# EAGLE design power (EAGLE 9.6.2)
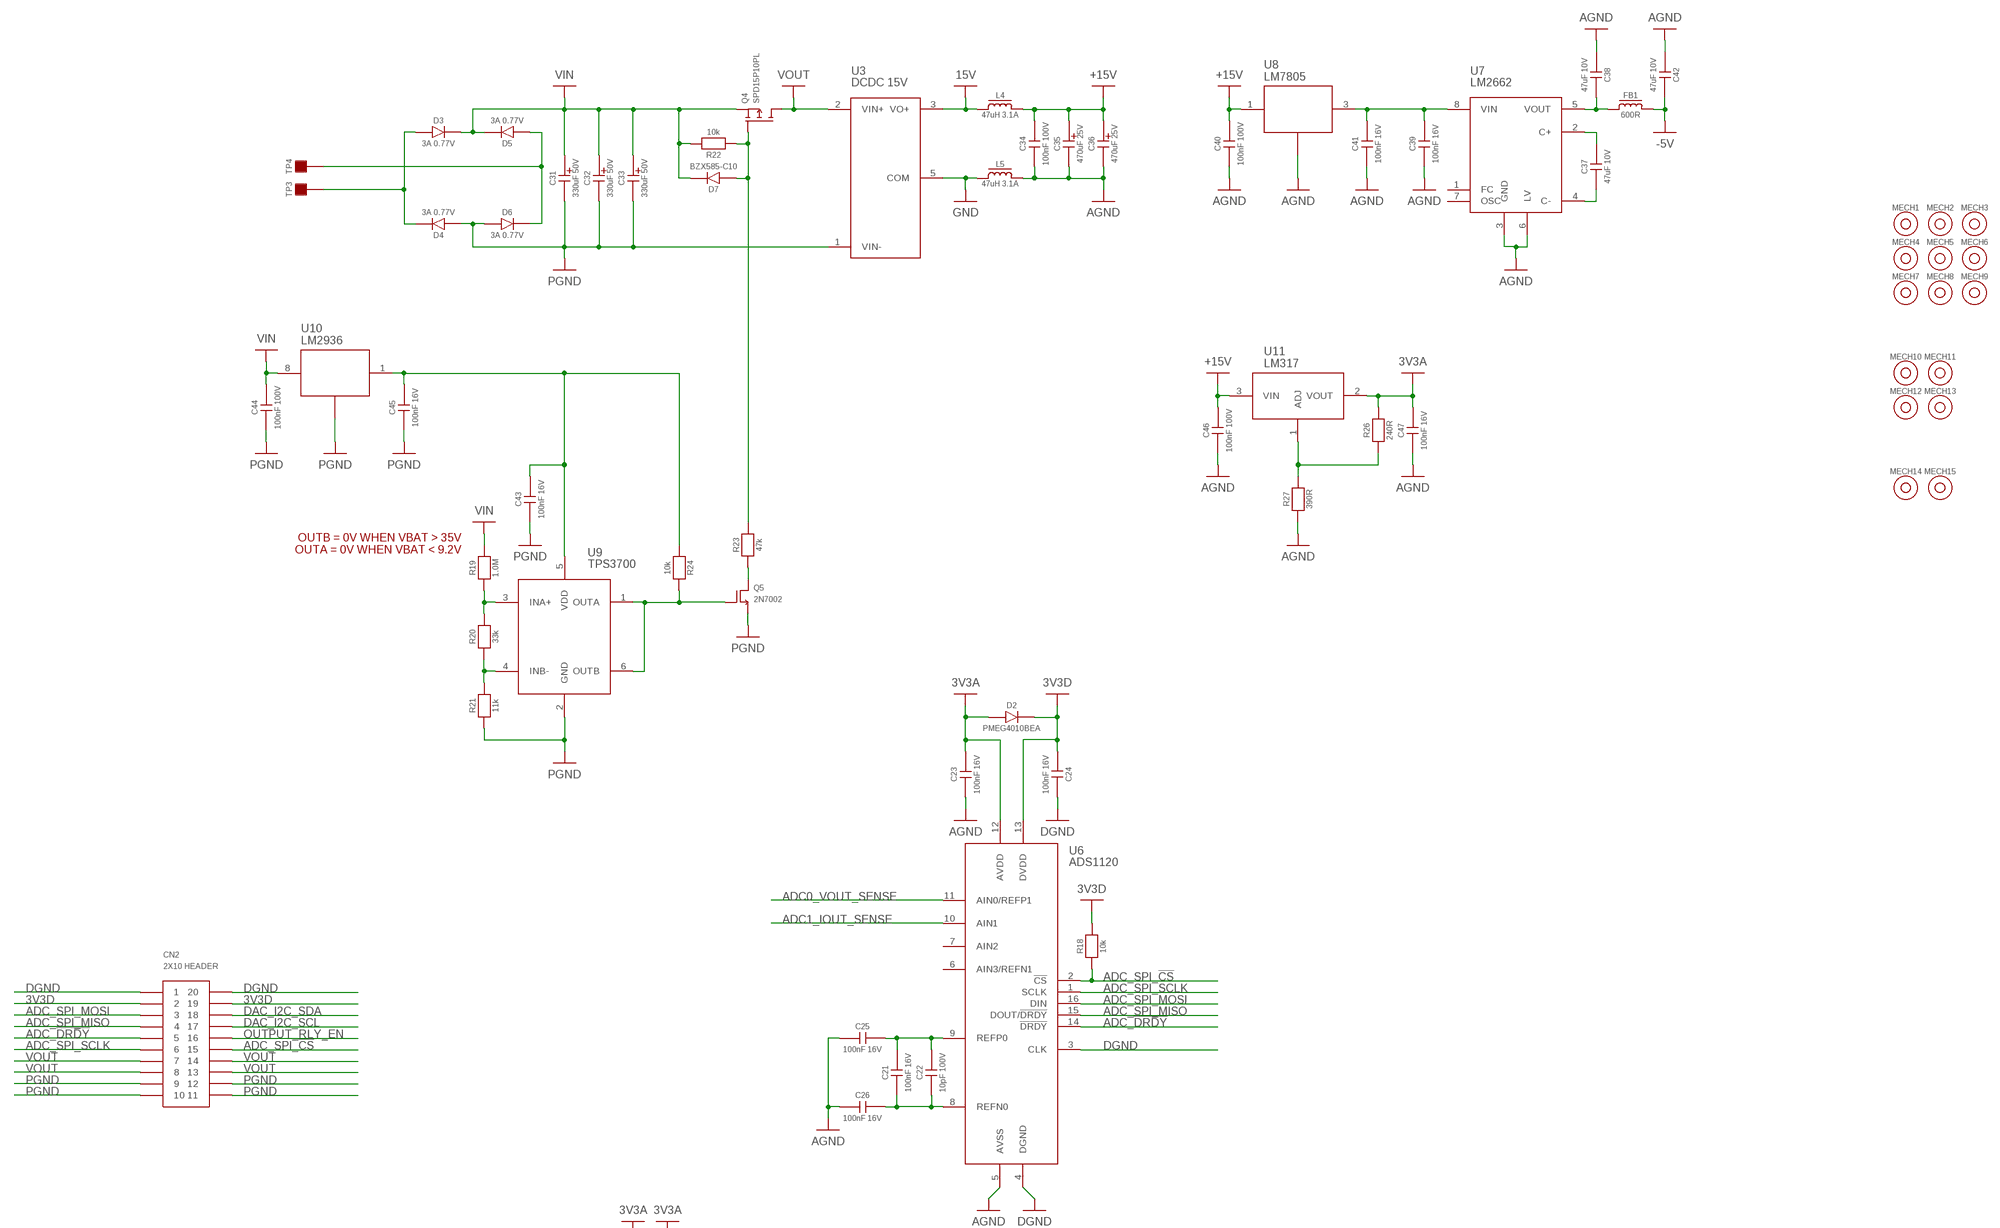
[diagram p0: schematic, sheet 1, part 1 of 2]
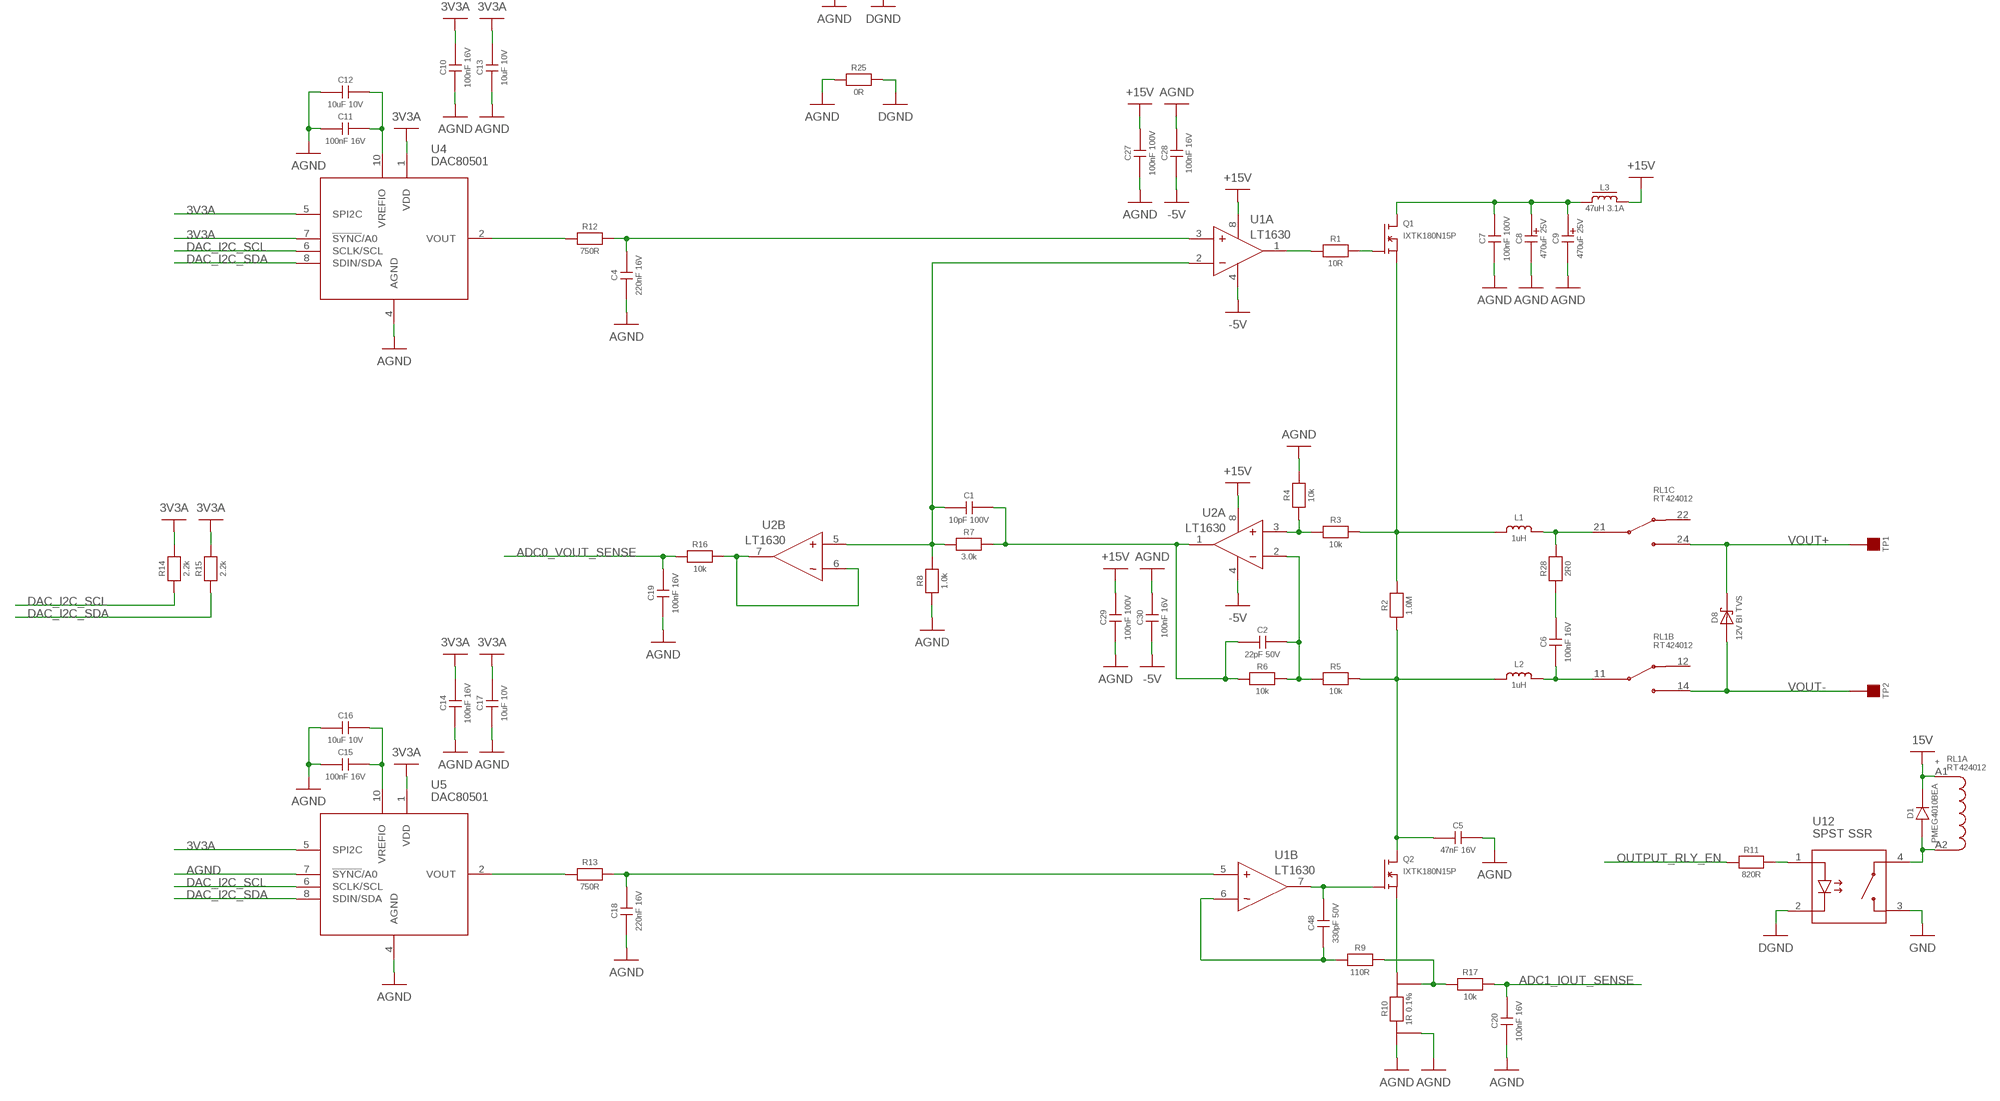
[diagram p1: schematic, sheet 1, part 2 of 2]

## Parts
C1  10pF 100V  06031A100FAT2A  [0603]
C2  22pF 50V  06035A220JAT2A  [0603]
C4  220nF 16V  CC0603KRX7R7BB224  [0603]
C5  47nF 16V  CL10B473KO8NNNC  [0603]
C6  100nF 16V  CL10B104KO8WPNC  [0603]
C7  100nF 100V  06031C104KAT2A  [0603]
C8  470uF 25V  ECA-1EM471  [10MM_RADIAL_5MM_PITCH]
C9  470uF 25V  ECA-1EM471  [10MM_RADIAL_5MM_PITCH]
C10  100nF 16V  CL10B104KO8WPNC  [0603]
C11  100nF 16V  CL10B104KO8WPNC  [0603]
C12  10uF 10V  GRM188R61A106KE69D  [0603]
C13  10uF 10V  GRM188R61A106KE69D  [0603]
C14  100nF 16V  CL10B104KO8WPNC  [0603]
C15  100nF 16V  CL10B104KO8WPNC  [0603]
C16  10uF 10V  GRM188R61A106KE69D  [0603]
C17  10uF 10V  GRM188R61A106KE69D  [0603]
C18  220nF 16V  CC0603KRX7R7BB224  [0603]
C19  100nF 16V  CL10B104KO8WPNC  [0603]
C20  100nF 16V  CL10B104KO8WPNC  [0603]
C21  100nF 16V  CL10B104KO8WPNC  [0603]
C22  10pF 100V  06031A100FAT2A  [0603]
C23  100nF 16V  CL10B104KO8WPNC  [0603]
C24  100nF 16V  CL10B104KO8WPNC  [0603]
C25  100nF 16V  CL10B104KO8WPNC  [0603]
C26  100nF 16V  CL10B104KO8WPNC  [0603]
C27  100nF 100V  06031C104KAT2A  [0603]
C28  100nF 16V  CL10B104KO8WPNC  [0603]
C29  100nF 100V  06031C104KAT2A  [0603]
C30  100nF 16V  CL10B104KO8WPNC  [0603]
C31  330uF 50V  860020675021  [10MM_RADIAL_5MM_PITCH]
C32  330uF 50V  860020675021  [10MM_RADIAL_5MM_PITCH]
C33  330uF 50V  860020675021  [10MM_RADIAL_5MM_PITCH]
C34  100nF 100V  06031C104KAT2A  [0603]
C35  470uF 25V  ECA-1EM471  [10MM_RADIAL_5MM_PITCH]
C36  470uF 25V  ECA-1EM471  [10MM_RADIAL_5MM_PITCH]
C37  47uF 10V  GRM31CR61A476ME15L  [1206]
C38  47uF 10V  GRM31CR61A476ME15L  [1206]
C39  100nF 16V  CL10B104KO8WPNC  [0603]
C40  100nF 100V  06031C104KAT2A  [0603]
C41  100nF 16V  CL10B104KO8WPNC  [0603]
C42  47uF 10V  GRM31CR61A476ME15L  [1206]
C43  100nF 16V  CL10B104KO8WPNC  [0603]
C44  100nF 100V  06031C104KAT2A  [0603]
C45  100nF 16V  CL10B104KO8WPNC  [0603]
C46  100nF 100V  06031C104KAT2A  [0603]
C47  100nF 16V  CL10B104KO8WPNC  [0603]
C48  330pF 50V  CC0603JRNPO9BN331  [0603]
CN2  2X10 HEADER  2X10_HEADER_FEMALE  [2X10PIN_HEADER]
D1  PMEG4010BEA  [SOD-323]
D2  PMEG4010BEA  [SOD-323]
D3  3A 0.77V  PMEG10030ELP  [SOD128]
D4  3A 0.77V  PMEG10030ELP  [SOD128]
D5  3A 0.77V  PMEG10030ELP  [SOD128]
D6  3A 0.77V  PMEG10030ELP  [SOD128]
D7  BZX585-C10  BZT52C10T-7  [SOD_523]
D8  12V BI TVS  SMBJ12CA-13-F  [DO214AC]
FB1  600R  742792651  [0603]
L1  1uH  GS-1R00-1310  [DIY_10X13MM_INDUCTOR]
L2  1uH  GS-1R00-1310  [DIY_10X13MM_INDUCTOR]
L3  47uH 3.1A  SRR1210-470M  [SRR1210]
L4  47uH 3.1A  SRR1210-470M  [SRR1210]
L5  47uH 3.1A  SRR1210-470M  [SRR1210]
MECH1  6mm x 3mm  MOUNTHOLE  [MOUNTHOLE_6X3]
MECH2  6mm x 3mm  MOUNTHOLE  [MOUNTHOLE_6X3]
MECH3  6mm x 3mm  MOUNTHOLE  [MOUNTHOLE_6X3]
MECH4  6mm x 3mm  MOUNTHOLE  [MOUNTHOLE_6X3]
MECH5  6mm x 3mm  MOUNTHOLE  [MOUNTHOLE_6X3]
MECH6  6mm x 3mm  MOUNTHOLE  [MOUNTHOLE_6X3]
MECH7  6mm x 3mm  MOUNTHOLE  [MOUNTHOLE_6X3]
MECH8  6mm x 3mm  MOUNTHOLE  [MOUNTHOLE_6X3]
MECH9  6mm x 3mm  MOUNTHOLE  [MOUNTHOLE_6X3]
MECH10  6mm x 3mm  MOUNTHOLE  [MOUNTHOLE_6X3]
MECH11  6mm x 3mm  MOUNTHOLE  [MOUNTHOLE_6X3]
MECH12  6mm x 3mm  MOUNTHOLE  [MOUNTHOLE_6X3]
MECH13  6mm x 3mm  MOUNTHOLE  [MOUNTHOLE_6X3]
MECH14  6mm x 3mm  MOUNTHOLE  [MOUNTHOLE_6X3]
MECH15  6mm x 3mm  MOUNTHOLE  [MOUNTHOLE_6X3]
Q1  IXTK180N15P  [TO264F]
Q2  IXTK180N15P  [TO264F]
Q4  SPD15P10PL  [TO252]
Q5  2N7002  2N7002P,215  [SOT23-3]
R1  10R  ERJ3EKF10R0V  [0603]
R2  1.0M  ERJ3EKF1004V  [0603]
R3  10k  ERJ3EKF1002V  [0603]
R4  10k  ERJ3EKF1002V  [0603]
R5  10k  ERJ3EKF1002V  [0603]
R6  10k  ERJ3EKF1002V  [0603]
R7  3.0k  ERJ3EKF3001V  [0603]
R8  1.0k  ERJ3EKF1001V  [0603]
R9  110R  ERJ3EKF1100V  [0603]
R10  1R 0.1%  Y16061R00000B9W  [2512_4WIRE]
R11  820R  ERJ3EKF8200V  [0603]
R12  750R  ERJ3EKF7500V  [0603]
R13  750R  ERJ3EKF7500V  [0603]
R14  2.2k  ERJ3EKF2201V  [0603]
R15  2.2k  ERJ3EKF2201V  [0603]
R16  10k  ERJ3EKF1002V  [0603]
R17  10k  ERJ3EKF1002V  [0603]
R18  10k  ERJ3EKF1002V  [0603]
R19  1.0M  ERJ3EKF1004V  [0603]
R20  33k  ERJ3EKF3302V  [0603]
R21  11k  ERJ3EKF1102V  [0603]
R22  10k  ERJ3EKF1002V  [0603]
R23  47k  ERJ3EKF4702V  [0603]
R24  10k  ERJ3EKF1002V  [0603]
R25  0R  CRCW06030000Z0EA  [0603]
R26  240R  ERJ3EKF2400V  [0603]
R27  390R  ERJ3EKF3900V  [0603]
R28  2R0  CRCW12062R00FNEA  [1206]
RL1  RT424012  [30MMDPDTRELAY]
TP1  TEST_POINT_SQUARE  [OSPREY_HSS_PAD]
TP2  TEST_POINT_SQUARE  [OSPREY_HSS_PAD]
TP3  TEST_POINT_SQUARE  [OSPREY_HSS_PAD]
TP4  TEST_POINT_SQUARE  [OSPREY_HSS_PAD]
U1  LT1630  LT1630CS8  [SO8]
U2  LT1630  LT1630CS8  [SO8]
U3  DCDC 15V  PDQE20-Q24-S15-D  [PDQE10]
U4  DAC80501  [VSSOP10]
U5  DAC80501  [VSSOP10]
U6  ADS1120  [TSSOP16]
U7  LM2662  LM2662D  [SO8]
U8  LM7805  7805CTG  [TO220]
U9  TPS3700  TPS3700DDCR  [SOT23-6]
U10  LM2936  LM2936HVMAX-5.0  [SO8]
U11  LM317  LM317T  [TO220]
U12  SPST SSR  CPC1002N  [CPC1002N]

## Nets
3V3A: C10.2 C13.2 C14.2 C17.2 C23.2 C47.2 D2.A R14.2 R15.2 R26.2 U4.1(VDD) U4.5(SPI2C) U4.7(!SYNC!/A0) U5.1(VDD) U5.5(SPI2C) U6.12(AVDD) U11.2(VOUT)
3V3D: C24.1 CN2.2 CN2.19 D2.K R18.2 U6.13(DVDD)
15V: D1.K L4.1 RL1.A1(A:A1) U3.3(VO+)
+15V: C27.2 C29.2 C34.2 C35.2(A) C36.2(A) C40.2 C46.2 L3.2 L4.2 U1.8(A:V+) U2.8(A:V+) U8.1(VIN) U11.3(VIN)
-5V: C28.1 C30.1 C42.2 FB1.2 U1.4(A:V-) U2.4(A:V-)
ADC0_VOUT_SENSE: C19.2 R16.1 U6.11(AIN0/REFP1)
ADC1_IOUT_SENSE: C20.2 R17.2 U6.10(AIN1)
ADC_!DRDY: CN2.5 U6.14(!DRDY)
ADC_SPI_!CS: CN2.15 R18.1 U6.2(!CS)
ADC_SPI_MISO: CN2.4 U6.15(DOUT/!DRDY)
ADC_SPI_MOSI: CN2.3 U6.16(DIN)
ADC_SPI_SCLK: CN2.6 U6.1(SCLK)
AGND: C4.1 C5.2 C7.1 C8.1(K) C9.1(K) C10.1 C11.1 C12.1 C13.1 C14.1 C15.1 C16.1 C17.1 C18.1 C19.1 C20.1 C23.1 C25.1 C26.1 C27.1 C28.2 C29.1 C30.2 C34.1 C35.1(K) C36.1(K) C38.1 C39.1 C40.1 C41.1 C42.1 C46.1 C47.1 L5.2 R4.2 R8.1 R10.1(E1) R10.2(I1) R25.1 R27.1 U4.4(AGND) U5.4(AGND) U5.7(!SYNC!/A0) U6.5(AVSS) U7.3(GND) U7.6(LV) U8.2(GND)
DAC_I2C_SCL: CN2.17 R14.1 U4.6(SCLK/SCL) U5.6(SCLK/SCL)
DAC_I2C_SDA: CN2.18 R15.1 U4.8(SDIN/SDA) U5.8(SDIN/SDA)
DGND: C24.2 CN2.1 CN2.20 R25.2 U6.3(CLK) U6.4(DGND) U12.2(LED_K)
GND: L5.1 U3.5(COM) U12.3(SW2)
N$1: R1.1 U1.1(A:OUT)
N$2: Q1.1(G) R1.2
N$3: L1.1 Q1.3(S) R2.2 R3.2
N$4: C5.1 L2.1 Q2.2(D) R2.1 R5.2
N$5: R3.1 R4.1 U2.3(A:+)
N$6: C2.2 R5.1 R6.2 U2.2(A:-)
N$7: C1.2 C2.1 R6.1 R7.2 U2.1(A:OUT)
N$8: R16.2 U2.6(B:-) U2.7(B:OUT)
N$9: C48.2 Q2.1(G) U1.7(B:OUT)
N$10: C4.2 R12.2 U1.3(A:+)
N$11: C48.1 R9.1 U1.6(B:-)
N$12: L1.2 R28.2 RL1.21
N$13: R11.2 U12.1(LED_A)
N$14: C6.1 L2.2 RL1.11
N$15: R26.1 R27.2 U11.1(ADJ)
N$16: C21.2 C22.2 C25.2 U6.9(REFP0)
N$17: C7.2 C8.2(A) C9.2(A) L3.1 Q1.2(D)
N$18: C18.2 R13.2 U1.5(B:+)
N$19: D1.A RL1.A2(A:A2) U12.4(SW1)
N$20: C11.2 C12.2 U4.10(VREFIO)
N$21: R12.1 U4.2(VOUT)
N$22: C15.2 C16.2 U5.10(VREFIO)
N$23: R13.1 U5.2(VOUT)
N$24: C21.1 C22.1 C26.2 U6.8(REFN0)
N$25: C43.2 C45.2 R24.1 U9.5(VDD) U10.1(VOUT)
N$26: D5.A D6.K TP4.1
N$27: D3.A D4.K TP3.1
N$28: C6.2 R28.1
N$29: Q2.3(S) R10.4(I2)
N$30: C37.2 U7.2(C+)
N$31: C37.1 U7.4(C-)
N$32: C38.2 FB1.1 U7.5(VOUT)
N$33: C39.2 C41.2 U7.8(VIN) U8.3(VOUT)
N$34: R19.1 R20.2 U9.3(INA+)
N$35: R20.1 R21.2 U9.4(INB-)
N$37: D7.A Q4.1(G) R22.1 R23.2
N$38: Q5.2(D) R23.1
N$39: Q5.1(G) R24.2 U9.1(OUTA) U9.6(OUTB)
N$76: R9.2 R10.3(E2) R17.1
N$345: C1.1 R7.1 R8.2 U1.2(A:-) U2.5(B:+)
OUTPUT_RLY_EN: CN2.16 R11.1
PGND: C31.1(K) C32.1(K) C33.1(K) C43.1 C44.1 C45.1 CN2.9 CN2.10 CN2.11 CN2.12 D4.A D6.A Q5.3(S) R21.1 U3.1(VIN-) U9.2(GND) U10.2(GND) U10.3(GND) U10.6(GND) U10.7(GND)
VIN: C31.2(A) C32.2(A) C33.2(A) C44.2 D3.K D5.K D7.K Q4.3(S) R19.2 R22.2 U10.8(VIN)
VOUT: CN2.7 CN2.8 CN2.13 CN2.14 Q4.2(D) U3.2(VIN+)
VOUT+: D8.K RL1.24 TP1.1
VOUT-: D8.A RL1.14 TP2.1
Unconnected: RL1.12 RL1.22 U6.6(AIN3/REFN1) U6.7(AIN2) U7.1(FC) U7.7(OSC)

## Notes on the sheet
- OUTB = 0V WHEN VBAT > 35V
  OUTA = 0V WHEN VBAT < 9.2V

## Library data of the parts
C1 C22 = CAPACITORS:06031A100FAT2A: 10pF 100V C0G/NP0 1% 0603 MLCC.; DIGIKEY: 478-5769-1-ND; HEIGHT: 1; PRICE_PER: 0.23
C2 = CAPACITORS:06035A220JAT2A: 22pF 50V C0G/NP0 5% 0603 MLCC.; DIGIKEY: 478-1167-1-ND; HEIGHT: 1; PRICE_PER: 0.08
C4 C18 = CAPACITORS:CC0603KRX7R7BB224: 220nF 16V X7R 10% 0603 MLCC.; DIGIKEY: 311-1426-1-ND; HEIGHT: 1; PRICE_PER: 0.08
C5 = CAPACITORS:CL10B473KO8NNNC: 47nF 16V X7R 10% 0603 MLCC.; DIGIKEY: 1276-2079-1-ND; HEIGHT: 1; PRICE_PER: 0.08
C6 C10 C11 C14 C15 C19-C21 C23-C26 C28 C30 C39 C41 C43 C45 C47 = CAPACITORS:CL10B104KO8WPNC: 100nF 16V X7R 10% 0603 MLCC; DIGIKEY: 1276-6582-1-ND; HEIGHT: 1; PRICE_PER: 0.08
C7 C27 C29 C34 C40 C44 C46 = CAPACITORS:06031C104KAT2A: 100nF 100V X7R 10% 0603 MLCC.; DIGIKEY: 478-10047-1-ND; HEIGHT: 1; PRICE_PER: 0.14
C8 C9 C35 C36 = CAPACITORS:ECA-1EM471: 470uF 25V Electrolytic 20% 10mm radial.; DIGIKEY: P5155-ND; HEIGHT: 14; PRICE_PER: 0.37
C12 C13 C16 C17 = CAPACITORS:GRM188R61A106KE69D: 10uF 10V X5R 10% 0603 MLCC.; DIGIKEY: 490-10474-1-ND; HEIGHT: 0.95; PRICE_PER: 0.17
C31-C33 = CAPACITORS:860020675021: 330uF 50V Electrolytic 20% 10mm radial 16mm height.; DIGIKEY: 732-8867-1-ND; HEIGHT: 17.5; PRICE_PER: 0.52
C37 C38 C42 = CAPACITORS:GRM31CR61A476ME15L: 47uF 10V X5R 20% 1206 MLCC.; DIGIKEY: 490-5528-1-ND; HEIGHT: 2; PRICE_PER: 0.65
C48 = CAPACITORS:CC0603JRNPO9BN331: 330pF 50V C0G/NP0 5% 0603 MLCC; DIGIKEY: 311-1075-1-ND; HEIGHT: 1; PRICE_PER: 0.1
CN2 = CONNECTORs:2X10_HEADER_FEMALE: A 2 row, 10 column, 20 pin 0.1" female header.; DIGIKEY: 2057-RS2-20-G-ND; HEIGHT: 8.5; PRICE_PER: 0.85
D1 D2 = DIODES:PMEG4010BEA: 1A, 40V Schottkey rectifier. SOD323.; DIGIKEY: 1727-5211-1-ND; HEIGHT: 1.2; PRICE_PER: 0.29
D3-D6 = DIODES:PMEG10030ELP: Schottky Rectifier, 100 V, 3 A, Single, SOD-128, 2 Pins, 770 mV; DIGIKEY: 1727-2397-1-ND; HEIGHT: 3; PRICE_PER: 0.37
D7 = DIODES:BZT52C10T-7: Zener Single Diode, 10 V, 300 mW, SOD-523, 2, 150 °C; DIGIKEY: BZT52C10T-7DICT-ND; HEIGHT: 1; PRICE_PER: 0.16
D8 = DIODES:SMBJ12CA-13-F: 19.9V Clamp 30.2A Ipp Tvs Diode Surface Mount SMB; DIGIKEY: SMBJ12CA-FDICT-ND; HEIGHT: 2.5; PRICE_PER: 0.29
FB1 = INDUCTORS:742792651: Ferrite Bead 600R at 100MHz 0603.; DIGIKEY: 732-1593-1-ND; HEIGHT: 1; PRICE_PER: 0.13
L1 L2 = INDUCTORS:GS-1R00-1310: A 1uH inductor made from ten 13mm diameter turns from 1mm diameter enamled wire.; HEIGHT: 14
L3-L5 = INDUCTORS:SRR1210-470M: 47µH Shielded Wirewound Inductor 3.8A 72 mOhm Max Nonstandard; DIGIKEY: SRR1210-470MCT-ND; HEIGHT: 10; PRICE_PER: 1
MECH1-MECH15 = MISC:MOUNTHOLE: Mechanical mounting hole.
Q1 Q2 = TRANSISTORs:IXTK180N15P: N Channel, 180 A, 150 V, 10 mohm, 10 V, 5 V; DIGIKEY: IXTK180N15P-ND; HEIGHT: 29; PRICE_PER: 9.57
Q4 = TRANSISTORs:SPD15P10PL: INFINEON SPD15P10PL G MOSFET Transistor, P Channel, -15 A, -100 V, 0.14 ohm, -10 V, -1.5 V; DIGIKEY: SPD15P10PLGBTMA1CT-ND; HEIGHT: 4; PRICE_PER: 1.29
Q5 = TRANSISTORs:2N7002: N-Channel 60V 360mA (Ta) 350mW (Ta) Surface Mount TO-236AB (SOT23); DIGIKEY: 1727-4692-1-ND; HEIGHT: 1; PRICE_PER: 0.15
R1 = r_0603:ERJ3EKF10R0V: 10 10R 0603 0.1W 1% thick film resistor.; DIGIKEY: P10.0HCT-ND; PRICE_PER: 0.10000
R2 R19 = r_0603:ERJ3EKF1004V: 1000000 1.0M 0603 0.1W 1% thick film resistor.; DIGIKEY: P1.00MHCT-ND; PRICE_PER: 0.10000
R3-R6 R16-R18 R22 R24 = r_0603:ERJ3EKF1002V: 10000 10k 0603 0.1W 1% thick film resistor.; DIGIKEY: P10.0KHCT-ND; PRICE_PER: 0.10000
R7 = r_0603:ERJ3EKF3001V: 3000 3.0k 0603 0.1W 1% thick film resistor.; DIGIKEY: P3.00KHCT-ND; PRICE_PER: 0.10000
R8 = r_0603:ERJ3EKF1001V: 1000 1.0k 0603 0.1W 1% thick film resistor.; DIGIKEY: P1.00KHCT-ND; PRICE_PER: 0.10000
R9 = r_0603:ERJ3EKF1100V: 110 110R 0603 0.1W 1% thick film resistor.; DIGIKEY: P110HCT-ND; PRICE_PER: 0.10000
R10 = RESISTORS:Y16061R00000B9W: 1 Ohms ±0.1% 1W Chip Resistor Wide 2516 (6440 Metric), 1625 Current Sense, Moisture Resistant, Non-Inductive Metal Foil; DIGIKEY: Y1606-1.0B-ND; HEIGHT: 1; PRICE_PER: 12.53
R11 = r_0603:ERJ3EKF8200V: 820 820R 0603 0.1W 1% thick film resistor.; DIGIKEY: P820HCT-ND; PRICE_PER: 0.10000
R12 R13 = r_0603:ERJ3EKF7500V: 750 750R 0603 0.1W 1% thick film resistor.; DIGIKEY: P750HCT-ND; PRICE_PER: 0.10000
R14 R15 = r_0603:ERJ3EKF2201V: 2200 2.2k 0603 0.1W 1% thick film resistor.; DIGIKEY: P2.20KHCT-ND; PRICE_PER: 0.10000
R20 = r_0603:ERJ3EKF3302V: 33000 33k 0603 0.1W 1% thick film resistor.; DIGIKEY: P33.0KHCT-ND; PRICE_PER: 0.10000
R21 = r_0603:ERJ3EKF1102V: 11000 11k 0603 0.1W 1% thick film resistor.; DIGIKEY: P11.0KHCT-ND; PRICE_PER: 0.10000
R23 = r_0603:ERJ3EKF4702V: 47000 47k 0603 0.1W 1% thick film resistor.; DIGIKEY: P47.0KHCT-ND; PRICE_PER: 0.10000
R25 = RESISTORS:CRCW06030000Z0EA: 0 0R 0603 0.1W thick film resistor; DIGIKEY: 541-0.0GCT-ND; HEIGHT: 0.5; PRICE_PER: 0.08
R26 = r_0603:ERJ3EKF2400V: 240 240R 0603 0.1W 1% thick film resistor.; DIGIKEY: P240HCT-ND; PRICE_PER: 0.10000
R27 = r_0603:ERJ3EKF3900V: 390 390R 0603 0.1W 1% thick film resistor.; DIGIKEY: P390HCT-ND; PRICE_PER: 0.10000
R28 = RESISTORS:CRCW12062R00FNEA: 2 2R0 1206 0.25W 1% thick film resistor; DIGIKEY: 311-2.0ERCT-ND; HEIGHT: 0.65; PRICE_PER: 0.09
RL1 = ELECTROMECH:RT424012: General Purpose Relay DPDT (2 Form C) 12VDC Coil Through Hole; DIGIKEY: PB967-ND; HEIGHT: 16; PRICE_PER: 1.83
TP1-TP4 = MISC:TEST_POINT_SQUARE: A square pad initially made for the HSS wiring
U1 U2 = ICs:LT1630: 30MHz, 10V/µs, Dual Rail-to-Rail Input and Output Precision Op Amps; DIGIKEY: LT1630CS8#PBF-ND; HEIGHT: 2; PRICE_PER: 5.86
U3 = ICs:PDQE20-Q24-S15-D: Isolated Module DC DC Converter 1 Output 15V 1.333A 9V - 36V Input; DIGIKEY: 102-6269-ND; HEIGHT: 12; PRICE_PER: 17.06
U4 U5 = ICs:DAC80501: 16-Bit 1-LSB INL, Voltage-Output DAC With Precision Internal Reference; DIGIKEY: 296-DAC80501ZDGSRCT-ND; HEIGHT: 1; PRICE_PER: 4.40
U6 = ICs:ADS1120: ADS1120 4-Channel, 2-kSPS, Low-Power, 16-Bit ADC with Integrated PGA and Reference; DIGIKEY: 296-37280-1-ND; HEIGHT: 1; PRICE_PER: 5.25
U7 = ICs:LM2662: Low cost. SO8. LM266x switched capacitor negative voltage rail generator.; DIGIKEY: LM2662MX/NOPBCT-ND; HEIGHT: 1.5; PRICE_PER: 1.73
U8 = ICs:78: Linear Voltage Regulator, 78xx, Fixed, Positive, TO-220-3, 1.0 A Fixed Positive Voltage Regulators; DIGIKEY: MC7805CTGOS-ND; PRICE_PER: 0.35
U9 = ICs:TPS3700: Analogue Comparator, Rail to Rail, Voltage, 2, 1.8V to 18V, SOT-23, 6 Pins; DIGIKEY: 296-30395-1-ND; HEIGHT: 1; PRICE_PER: 1.46
U10 = ICs:LM2936HVMAX-5.0: Linear Voltage Regulator IC Positive Fixed 1 Output 5V 50mA 8-SOIC; DIGIKEY: LM2936HVMAX-5.0/NOPBCT-ND; HEIGHT: 1.5; PRICE_PER: 1.56
U11 = ICs:LM317: Linear Voltage Regulator, Adjustable, 38V primary input, 1.2V to 32V/100 mA/1 Output; DIGIKEY: 497-1575-5-ND; HEIGHT: 19; PRICE_PER: 0.5
U12 = ICs:CPC1002N: Solid State SPST-NO (1 Form A) 4-SOP (0.150", 3.81mm); DIGIKEY: CLA221-ND; HEIGHT: 2.1; PRICE_PER: 0.87

## Board
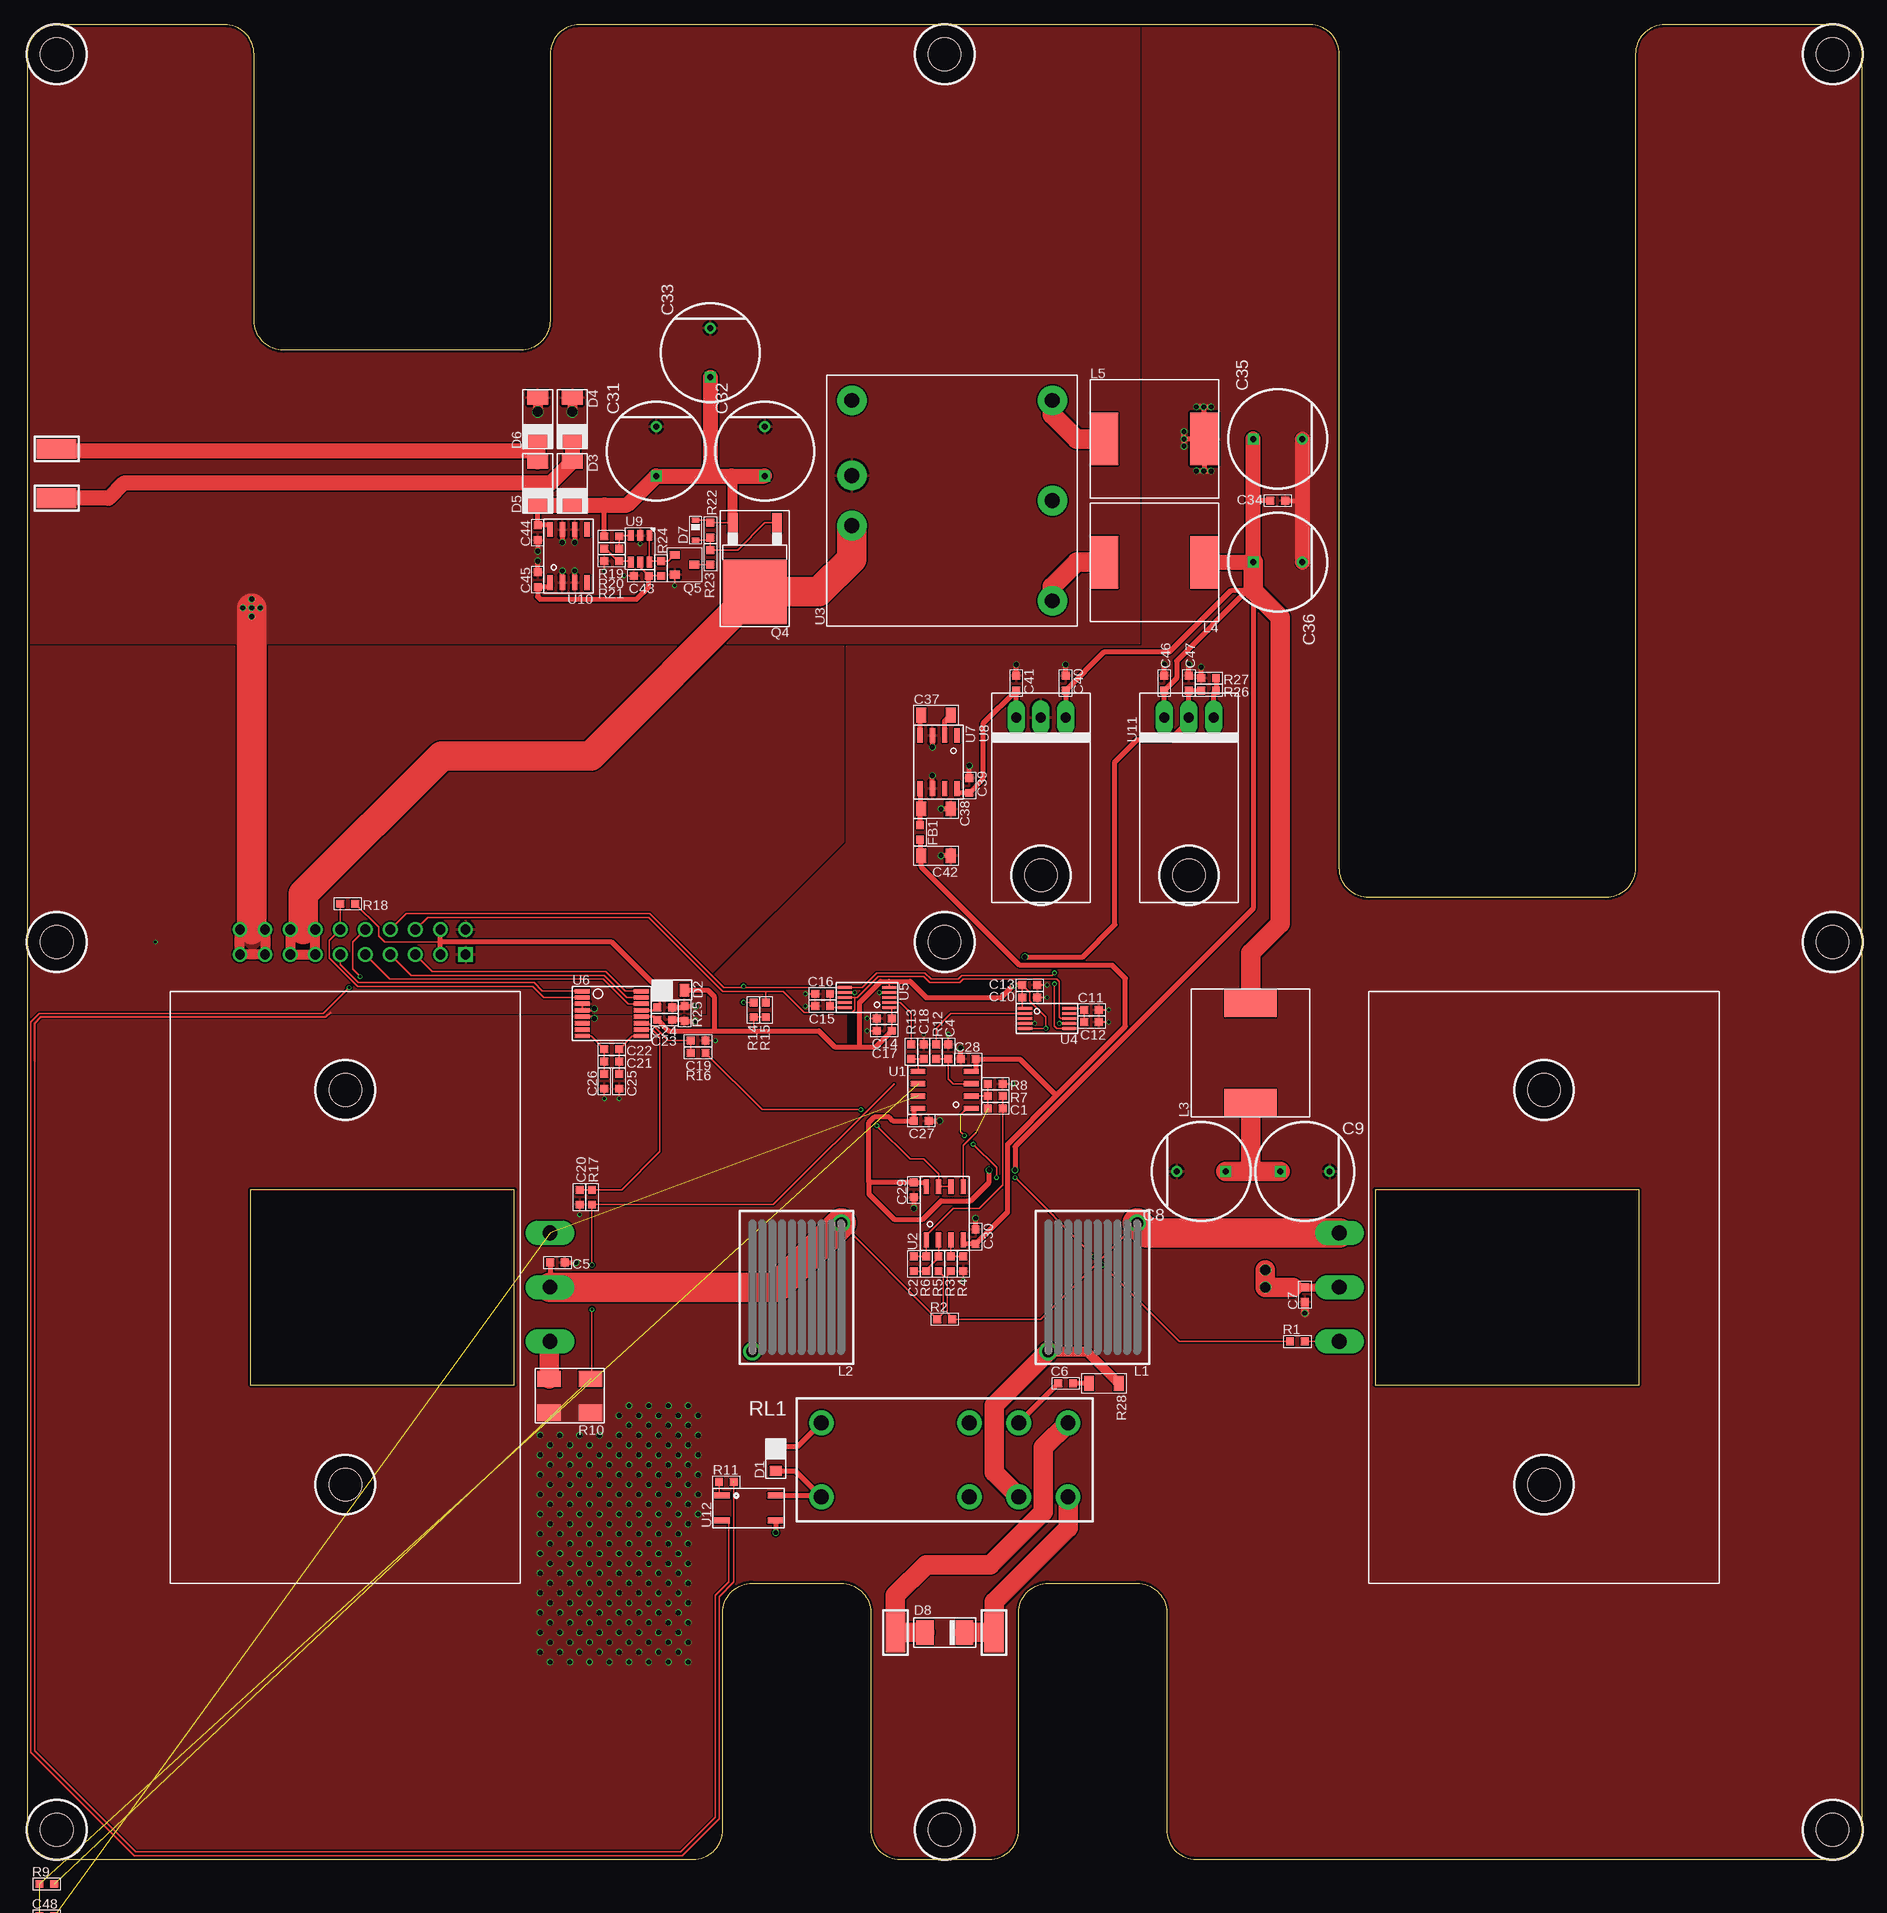
[diagram p2: board, top side]
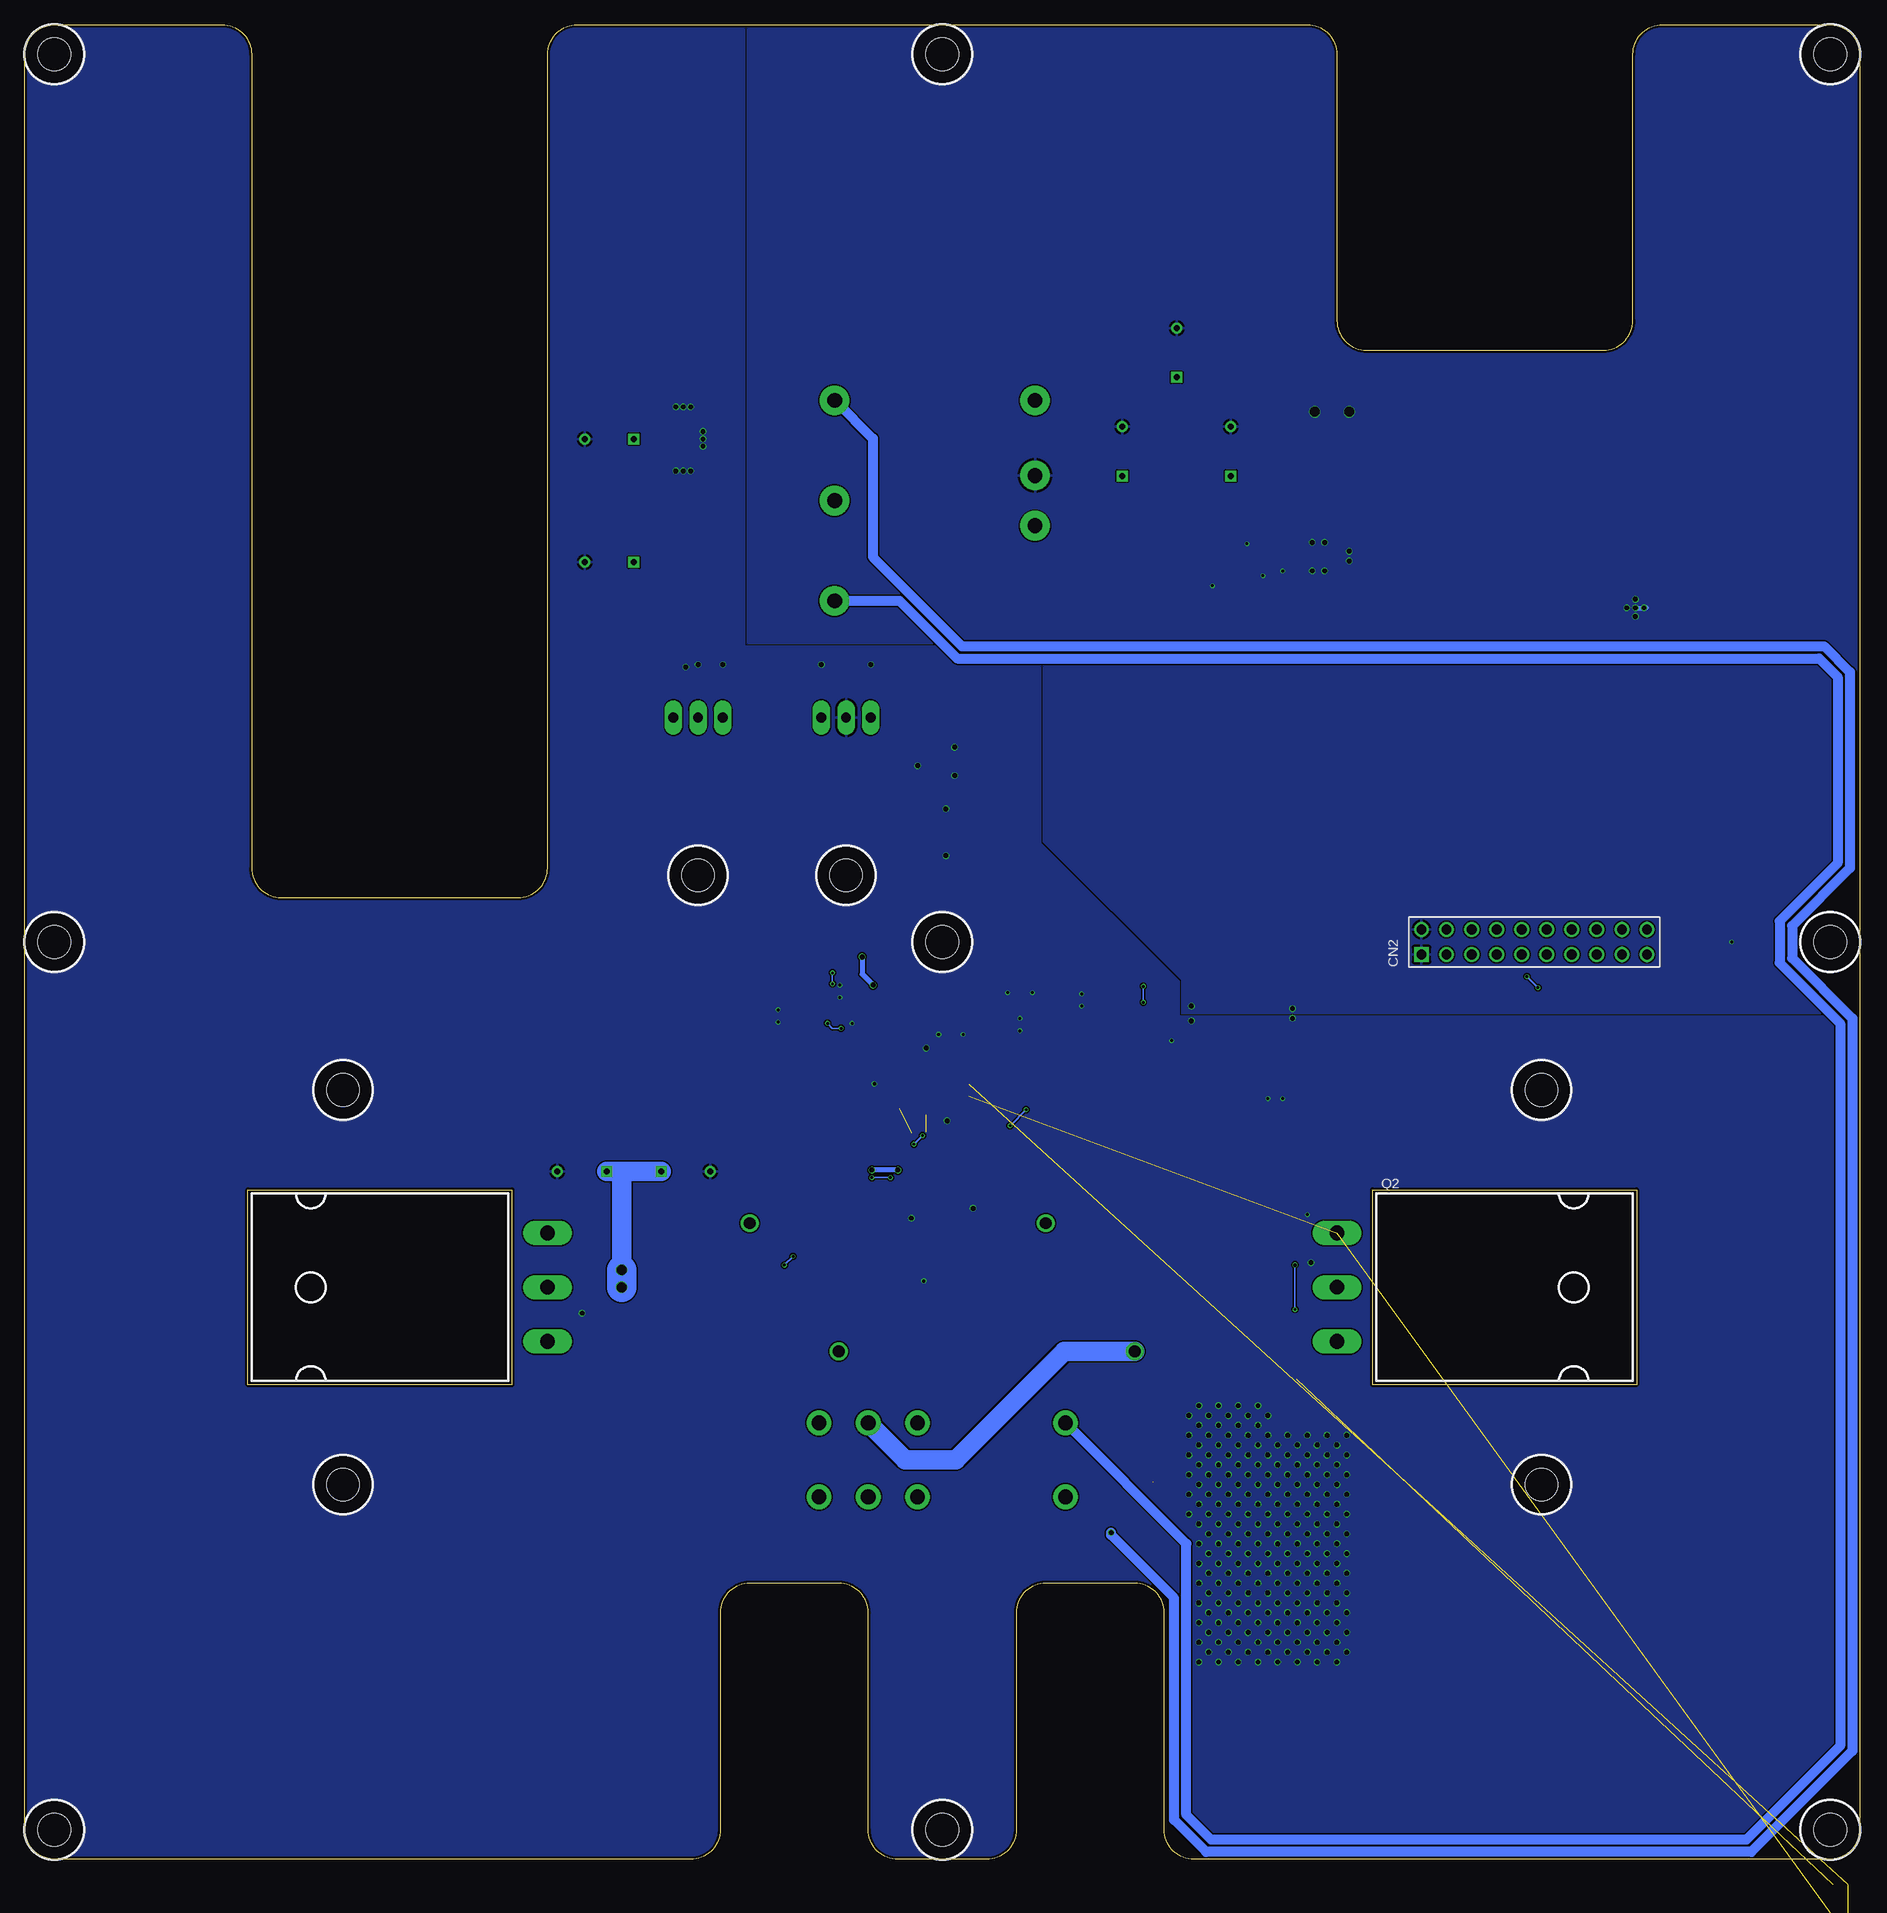
[diagram p3: board, bottom side, seen from below]

Size 186 x 186 mm. Coordinates in mm from the lower left corner, seen from the top.
Outline: 183,0 arc90 186,3 186,183 arc90 183,186 166,186 arc90 163,183 163,100.5 arc-90 160,97.5 136,97.5 arc-90 133,100.5 133,183 arc90 130,186 56,186 arc90 53,183 53,156 arc-90 50,153 26,153 arc-90 23,156 23,183 arc90 20,186 3,186 arc90 0,183 0,3 arc90 3,0 67.5,0 arc90 70.5,3 70.5,25 arc-90 73.5,28 82.5,28 arc-90 85.5,25 85.5,3 arc90 88.5,0 97.5,0 arc90 100.5,3 100.5,25 arc-90 103.5,28 112.5,28 arc-90 115.5,25 115.5,3 arc90 118.5,0 183,0
Outline: 22.62,48.12 49.38,48.12 49.38,67.88 22.62,67.88 22.62,48.12
Outline: 163.38,67.88 136.62,67.88 136.62,48.12 163.38,48.12 163.38,67.88
Copper layers (1*2*3*16): Top 0.035mm / dielectric 0.15mm / PWR 0.035mm / dielectric 1.11mm / GND 0.035mm / dielectric 0.2mm / Bottom 0.035mm
Design rules "myDRC 4 layers 0.15mm": minimum track width 0.15mm, minimum drill 0.25mm, track to track 0.15mm, track to pad 0.15mm, pad to pad 0.15mm, via to via 0.15mm, smd to smd 0mil, copper to edge 0.25mm, drill to drill 0.25mm, minimum pad ring 10mil, minimum via ring 3mil, stop-mask expansion 4mil, vias tented up to drill 1mm, thermal gap 10mil

### Footprints (pad centres in the part's own frame; a part is rotated, then mirrored left to right if it is on the bottom)
0603 = smd 0.8 x 0.8: 1 -0.75,0; 2 0.75,0
10MM_RADIAL_5MM_PITCH = drill 0.6: 1 2.5,0 | drill 0.6 square: 2 -2.5,0
1206 = smd 1 x 1.5: 1 1.5,0; 2 -1.5,0
2X10PIN_HEADER = drill 1 pad 1.5 square: 1 -1.27,11.43 | drill 1 pad 1.5: 2 -1.27,8.89; 3 -1.27,6.35; 4 -1.27,3.81; 5 -1.27,1.27; 6 -1.27,-1.27; 7 -1.27,-3.81; 8 -1.27,-6.35; 9 -1.27,-8.89; 10 -1.27,-11.43; 11 1.27,-11.43; 12 1.27,-8.89; 13 1.27,-6.35; 14 1.27,-3.81; 15 1.27,-1.27; 16 1.27,1.27; 17 1.27,3.81; 18 1.27,6.35; 19 1.27,8.89; 20 1.27,11.43
SOD-323 = smd 1 x 1.25: A -1.25,0; K 1.25,0
SOD128 = smd 1.4 x 2.1: A -2.2,0; K 2.2,0
SOD_523 = smd 0.5 x 0.75: A -1,0; K 1,0
DO214AC = smd 1.75 x 2.5: A -2,0; K 2,0
DIY_10X13MM_INDUCTOR = drill 1.2: 1 -4.5,-6.5; 2 4.5,6.5
SRR1210 = smd 2.8 x 5.3: 1 -5.05,0; 2 5.05,0
MOUNTHOLE_6X3 = hole 3.3: 0,0
TO264F = drill 1.5 pad 2.5 long: 1 -5.5,0; 2 0,0; 3 5.5,0
TO252 = smd 1 x 2: 1 -2.25,-5.25; 3 2.25,-5.25 | smd 6.5 x 6.5: 2 0,1.75
SOT23-3 = smd 0.8 x 1: 1 -1,-1; 2 0,1; 3 1,-1
2512_4WIRE = smd 2.4 x 1.65: 1 -2.1,1.7; 2 2.1,1.7; 3 -2.1,-1.7; 4 2.1,-1.7
30MMDPDTRELAY = drill 1.5 pad 2.5: 11 7.5,3.75; 12 2.5,3.75; 14 12.5,3.75; 21 7.5,-3.75; 22 2.5,-3.75; 24 12.5,-3.75; A1 -12.5,3.75; A2 -12.5,-3.75
OSPREY_HSS_PAD = smd 4 x 2: 1 0,0
SO8 = smd 1.5 x 0.55: 1 -2.7,1.875; 2 -2.7,0.625; 3 -2.7,-0.625; 4 -2.7,-1.875; 5 2.7,-1.875; 6 2.7,-0.625; 7 2.7,0.625; 8 2.7,1.875
PDQE10 = drill 1.5 pad 3: 1 2.54,10.16; 2 -2.54,10.16; 3 -10.16,-10.16; 4 0,-10.16; 5 10.16,-10.16; 6 10.16,10.16
VSSOP10 = smd 1.45 x 0.3: 1 -2.25,1; 2 -2.25,0.5; 3 -2.25,0; 4 -2.25,-0.5; 5 -2.25,-1; 6 2.25,-1; 7 2.25,-0.5; 8 2.25,0; 9 2.25,0.5; 10 2.25,1
TSSOP16 = smd 1.5 x 0.45: 1 -3,2.275; 2 -3,1.625; 3 -3,0.975; 4 -3,0.325; 5 -3,-0.325; 6 -3,-0.975; 7 -3,-1.625; 8 -3,-2.275; 9 3,-2.275; 10 3,-1.625; 11 3,-0.975; 12 3,-0.325; 13 3,0.325; 14 3,0.975; 15 3,1.625; 16 3,2.275
TO220 = drill 1 pad 1.75 long: 1 -2.5,0; 2 0,0; 3 2.5,0
SOT23-6 = smd 0.6 x 1.1: 1 0.95,1.35; 2 0,1.35; 3 -0.95,1.35; 4 -0.95,-1.35; 5 0,-1.35; 6 0.95,-1.35
CPC1002N = smd 1.54 x 0.6: 1 -2.695,1.27; 2 -2.695,-1.27; 3 2.695,-1.27; 4 2.695,1.27

### Placement (x,y rotation side)
C1  98.12,76.12 0 top
C2  89.88,60.38 270 top
C4  93.38,81.88 270 top
C5  53.75,60.5 0 top
C6  105.25,48.25 0 top
C7  129.5,57.25 90 top
C8  119,69.75 180 top
C9  129.5,69.75 0 top
C10  101.62,87.38 180 top
C11  107.88,86.12 180 top
C12  107.88,84.88 180 top
C13  101.62,88.62 180 top
C14  86.88,85.25 0 top
C15  80.62,86.5 0 top
C16  80.62,87.75 0 top
C17  86.88,84 0 top
C18  90.88,81.88 270 top
C19  68,83 180 top
C20  56,67.12 90 top
C21  59.25,80.88 0 top
C22  59.25,82.12 0 top
C23  64.62,85.12 180 top
C24  64.62,86.38 0 top
C25  60,78.88 90 top
C26  58.5,78.88 90 top
C27  90.62,74.88 180 top
C28  95.38,81.12 180 top
C29  89.88,67.88 90 top
C30  96.12,63.12 90 top
C31  63.75,142.75 90 top
C32  74.75,142.75 90 top
C33  69.25,152.75 90 top
C34  126.75,137.75 180 top
C35  126.75,144 0 top
C36  126.75,131.5 0 top
C37  92.12,116 180 top
C38  92.12,106.5 0 top
C39  95.5,108.88 270 top
C40  105.25,119.25 270 top
C41  100.25,119.25 270 top
C42  92.12,101.75 0 top
C43  62.25,130.12 0 top
C44  51.75,134.5 90 top
C45  51.75,129.75 270 top
C46  115.25,119.25 270 top
C47  117.75,119.25 270 top
C48  2,-5.75 0 top  (outside the outline)
CN2  33,93 90 bottom
D1  75.88,40.62 90 top
D2  65.38,88.12 180 top
D3  55.25,139.5 270 top
D4  55.25,146 270 top
D5  51.75,139.5 270 top
D6  51.75,146 270 top
D7  67.75,134.75 90 top
D8  93,23 0 top
FB1  90.5,104.12 270 top
L1  108,58 180 top
L2  78,58 180 top
L3  124,81.75 90 top
L4  114.25,131.5 0 top
L5  114.25,144 0 top
MECH1  3,3 0 top
MECH2  3,93 0 top
MECH3  3,183 0 top
MECH4  93,3 0 top
MECH5  93,93 0 top
MECH6  93,183 0 top
MECH7  183,3 0 top
MECH8  183,93 0 top
MECH9  183,183 0 top
MECH10  32.25,78 0 top
MECH11  153.75,78 0 top
MECH12  32.25,38 0 top
MECH13  153.75,38 0 top
MECH14  102.75,99.75 0 top
MECH15  117.75,99.75 0 top
Q1  133,58 90 bottom
Q2  53,58 270 bottom
Q4  73.75,130.25 180 top
Q5  66.62,131.25 270 top
R1  128.75,52.5 0 top
R2  93,54.75 0 top
R3  93.62,60.38 270 top
R4  94.88,60.38 270 top
R5  92.38,60.38 270 top
R6  91.12,60.38 270 top
R7  98.12,77.38 0 top
R8  98.12,78.62 180 top
R9  2,-2.5 0 top
R10  55,47 180 top
R11  70.88,38.25 180 top
R12  92.12,81.88 270 top
R13  89.62,81.88 270 top
R14  73.62,86.12 270 top
R15  74.88,86.12 270 top
R16  68,81.75 0 top
R17  57.25,67.12 90 top
R18  32.5,96.88 0 top
R19  59.25,134.12 180 top
R20  59.25,132.88 0 top
R21  59.25,131.62 0 top
R22  69.25,134.75 90 top
R23  69.25,132 90 top
R24  64.25,130.88 90 top
R25  66.62,85.75 90 top
R26  119.75,118.5 180 top
R27  119.75,119.75 0 top
R28  109.12,48.25 180 top
RL1  93,40.5 0 top
TP1  98,23 90 top
TP2  88,23 90 top
TP3  3,138 180 top
TP4  3,143 180 top
U1  93,78 180 top
U2  93,65.5 90 top
U3  93.75,137.75 90 top
U4  103.38,85.25 0 top
U5  85.12,87.38 180 top
U6  59.25,85.75 0 top
U7  92.38,111.25 270 top
U8  102.75,115.75 180 top
U9  62.12,132.88 0 top
U10  54.88,132.12 90 top
U11  117.75,115.75 180 top
U12  73.12,35.62 0 top

### Tracks (layer width: path | path; a pad name or v marks a point on that pad's centre or on a via)
3V3A  (via drill 0.3, 0.5)
  Top 0.15: U4.1 100.88,86.25 C10.2 C13.2 101.62,87.88 101.62,87 103.25,85.38 v103.25,84.25 U4.5 | U5.1 87.62,86.38 C14.2 C17.2 | U5.5 87.38,89 | U4.7 v104.62,84.75 | R15.2 R14.2 73.62,84
  Top 0.25: U6.12 63.58,85.42 C23.2
  Top 0.5: R26.2 C47.2 U11.2 117.75,115.38 115.88,113.5 112.5,113.5 110.25,111.25 110.25,94.75 107,91.5 v101.12,91.5 | D2.A 69,88.12 69.62,87.5 69.62,84 | 84.38,82.38 81.88,82.38 80.25,84 73.62,84 69.62,84 | C23.2 65,84 69.62,84 | 84.38,82.38 84.38,86.88 86.5,89 87.38,89 89.5,89 91.12,87.38 98.75,87.38 v100,88.62 C13.2 | 84.38,82.38 86,82.38 C17.2
  Bottom 0.15: v104.62,84.75 104.12,84.25 v103.25,84.25
  Bottom 0.5: v101.12,91.5 101.12,89.75 v100,88.62
3V3D
  Top 0.15: R18.2 35.62,94.5 35.62,93.62 36.25,93 41.88,93
  Top 0.25: U6.13 63.58,86.08 C24.1 64.12,86.62 D2.K
  Top 0.5: 41.88,93 41.88,94.25 CN2.19 | D2.K 59.25,93 41.88,93 | CN2.2 41.88,91.75 41.88,93
15V
  Top 0.5: RL1.A1 78.12,41.88 D1.K
  Top 2: U3.3 103.91,129.03 106.38,131.5 L4.1
  Bottom 1: U3.3 97.34,127.59 91.5,121.75 4.12,121.75 2.25,119.88 2.25,101 8.12,95.12 8.12,90.88 2,84.75 2,11.5 11.5,2 65.75,2 68.25,4.5 68.25,32 RL1.A1
+15V  (via drill 0.5)
  Top 0.5: U2.8 91.12,68.58 91.08,68.62 C29.2 85.31,68.62 | U1.8 89.92,76.12 89.88,76.08 C27.2 87.75,74.88 87.38,75.25 85.88,75.25 85.31,74.69 85.31,68.62 | U8.1 C40.2 109.12,122.38 115.75,122.38 122,128.62 123.62,128.62 | U11.3 C46.2 116.5,119.75 116.5,121.5 123.62,128.62 | C34.2 124.38,137.75 124.25,137.88 | 123.62,128.62 124.25,128.62 124.25,96.38 100.12,72.25 v100.12,69.88 | 85.31,68.62 85.31,67.44 87.88,64.88 90.75,64.88 92.62,66.75 95.62,66.75 97.5,68.62 v97.5,69.88
  Top 1.5: L4.2 C36.2 124.25,137.88 C35.2
  Top 2: C36.2 124.25,128.62 127,125.88 127,94.88 124,91.88 L3.2
  Bottom 0.5: v97.5,69.88 v100.12,69.88
-5V
  Top 0.5: U2.4 94.88,62.42 94.92,62.38 C30.1 99.38,65.62 99.38,72.5 104.31,77.44 | U1.4 96.08,79.88 96.12,79.92 C28.1 100.62,81.12 104.31,77.44 | FB1.2 90.5,101.88 C42.2 90.62,100.62 100.62,90.62 110,90.62 111.31,89.31 111.31,84.44 104.31,77.44
ADC0_VOUT_SENSE
  Top 0.15: U6.11 62.98,84.78 63.25,84.5 63.5,84.5 65,83 C19.2 R16.1
ADC1_IOUT_SENSE
  Top 0.15: C20.2 R17.2 60.25,67.88 | U6.10 63.38,84.12 64.12,83.38 64.12,73.88
  Top 0.152: 60.25,67.88 64.12,71.75 64.12,73.88
ADC_!DRDY
  Top 0.15: U6.14 60.9,86.72 58.38,89.25 37.38,89.25 36.75,89.25 CN2.5
ADC_SPI_!CS
  Top 0.15: U6.2 52.38,87.38 51.25,88.5 33.5,88.5 30.62,91.38 30.62,93.17 CN2.15 31.75,94.29 R18.1
ADC_SPI_MISO
  Top 0.15: U6.15 60.75,87.38 58.5,89.62 39.38,89.62 38.91,89.62 CN2.4
ADC_SPI_MOSI
  Top 0.15: U6.16 60.6,88.03 58.62,90 41.62,90 41.08,90 CN2.3
ADC_SPI_SCLK
  Top 0.15: U6.1 52.23,88.03 51.38,88.88 33.59,88.88 31.73,90.73 CN2.6
AGND  (via drill 0.3, 0.35, 0.5)
  Top 0.15: R4.2 v94.88,58.62 | R8.1 v99.88,78.62 | C4.1 v93.38,83.62 | C18.1 v90.88,83.62 | C20.1 v56,65.38 | C26.1 v58.5,77.12 | C25.1 v60,77.12 | C19.1 v69.75,83 | U4.4 v102.12,84.75 | C13.1 v103.38,88.62 | C10.1 v103.38,87.38 | C11.1 v109.62,86.12 | C12.1 v109.62,84.88 | C15.1 v78.88,86.5 | C16.1 v78.88,87.75 | U5.7 v83.88,87.88 | U5.4 v86.38,87.88 | C17.1 v85.12,84 | C14.1 v85.12,85.25
  Top 0.25: U6.5 57.33,85.42 v57.5,85.25
  Top 0.5: C5.2 v55.62,60.5 | C29.1 v89.88,66 | C30.2 v96.12,65 | C27.1 v92.5,74.88 | C28.2 v94.62,82.25 | U7.3 v91.75,112.75 | U7.6 v91.75,109.88 | C38.1 v92.62,106.5 | C39.1 v95.5,110.88 | C42.1 v92.62,101.75 | C40.1 v105.25,121.12 | C41.1 v100.25,121.12 | C47.1 v117.75,121.12 | R27.1 v119,120.88 | C46.1 v115.25,121.12 | C34.1 129.25,137.75 | L5.2 119.3,147.2 v119.25,147.25 | v119.25,147.25 v120,147.25 | v119.25,147.25 v118.5,147.25 | L5.2 119.3,140.8 v119.25,140.75 | v119.25,140.75 v118.5,140.75 | v119.25,140.75 v120,140.75 | L5.2 v117.25,144 | v117.25,144 v117.25,144.75 | v117.25,144 v117.25,143.25 | C23.1 66.5,85.12 R25.1 v67.75,85
  Top 0.8: C7.1 v129.5,55.38
  Top 1.5: C35.1 129.25,137.75 C36.1
  other vias: 52,43 54,43 56,43 58,43 60,43 62,43 64,43 66,43 68,43 53,42 55,42 57,42 59,42 61,42 63,42 65,42 67,42 52,41 54,41 56,41 58,41 60,41 62,41 64,41 66,41 68,41 53,40 55,40 57,40 59,40 61,40 63,40 65,40 67,40 52,39 54,39 56,39 58,39 60,39 62,39 64,39 66,39 68,39 53,38 55,38 57,38 59,38 61,38 63,38 65,38 67,38 52,37 54,37 56,37 58,37 60,37 62,37 64,37 66,37 68,37 53,36 55,36 57,36 59,36 61,36 63,36 65,36 67,36 52,35 54,35 56,35 58,35 60,35 62,35 64,35 66,35 68,35 53,34 55,34 57,34 59,34 61,34 63,34 65,34 67,34 52,33 54,33 56,33 58,33 60,33 62,33 64,33 66,33 53,32 55,32 57,32 59,32 61,32 63,32 65,32 67,32 52,31 54,31 56,31 58,31 60,31 62,31 64,31 66,31 53,30 55,30 57,30 59,30 61,30 63,30 65,30 67,30 52,29 54,29 56,29 58,29 60,29 62,29 64,29 66,29 53,28 55,28 57,28 59,28 61,28 63,28 65,28 67,28 52,27 54,27 56,27 58,27 60,27 62,27 64,27 66,27 53,26 55,26 57,26 59,26 61,26 63,26 65,26 67,26 52,25 54,25 56,25 58,25 60,25 62,25 64,25 66,25 53,24 55,24 57,24 59,24 61,24 63,24 65,24 67,24 52,23 54,23 56,23 58,23 60,23 62,23 64,23 66,23 53,22 55,22 57,22 59,22 61,22 63,22 65,22 67,22 52,21 54,21 56,21 58,21 60,21 62,21 64,21 66,21 53,20 55,20 57,20 59,20 61,20 63,20 65,20 67,20 61,46 63,46 65,46 67,46 60,45 62,45 64,45 66,45 68,45 61,44 63,44 65,44 67,44
  pour Top (no thermals): 51,47 69,47 69,19 51,19
  pour Bottom (rank 2): 0,0 186,0 186,186 113,186 113,123 83,123 83,103 69,89 69,85.5 0,85.5
  pour Top (rank 2): 0,0 186,0 186,186 113,186 113,123 83,123 83,103 69,89 69,85.5 0,85.5
DAC_I2C_SCL  (via drill 0.3)
  Top 0.15: U4.6 104.38,84.25 104.12,84.5 v104.12,88.75 | v104.12,89.88 103.88,89.62 94.75,89.62 94.38,89.25 91.62,89.25 91,89.88 86.12,89.88 84.62,88.38 U5.6 72.62,88.38 | 72.62,88.38 70.62,88.38 63.12,95.88 38.41,95.88 CN2.17 | R14.1 v72.62,86.88 | v72.62,88.5 72.62,88.38
  Bottom 0.15: v104.12,88.75 v104.12,89.88 | v72.62,86.88 v72.62,88.5
DAC_I2C_SDA
  Top 0.15: 83.88,87.38 84.12,87.38 86.25,89.5 90.88,89.5 91.5,88.88 94.5,88.88 94.88,89.25 104.38,89.25 104.62,89 104.62,85.38 104.75,85.25 U4.8 | 83.88,87.38 U5.8 | 83.88,87.38 83.88,86.12 83.62,85.88 78.75,85.88 76.62,88 74.88,88 | 74.88,88 70.5,88 63,95.5 41.62,95.5 40.58,95.5 CN2.18 | R15.1 74.88,88
DGND  (via drill 0.3, 0.5)
  Top 0.15: U6.3 U6.4 | U12.2 70.89,34.35 71.12,34.12 71.12,28.12 69.75,26.75 69.75,4.25 66.25,0.75 11,0.75 0.75,11 0.75,84.75 1.38,85.38 30.25,85.38 30.75,85.88
  Top 0.25: U6.4 57.33,86.08 v57.5,86.25
  Top 0.5: C24.2 66.5,86.38 R25.2 v67.75,86.5
  other vias: 13,93
  pour Bottom (rank 4): 83,123 0,123 0,81 83,81
  pour Top (rank 4): 83,123 0,123 0,81 83,81
GND  (via drill 0.5)
  Top 0.5: U12.3 75.88,34.3 v75.88,33.12
  Top 2: U3.5 103.91,146.47 106.38,144 L5.1
  Bottom 1: U3.5 100.03,144.03 100.03,132.03 91,123 3.62,123 1,120.38 1,100.5 6.88,94.62 6.88,91.38 0.75,85.25 0.75,11 11,0.75 66.25,0.75 69.5,4 69.5,26.5 75.88,32.88 v75.88,33.12
N$1  (via drill 0.3)  (1 unrouted)
  Top 0.15: v95.88,72.5 98.25,70.12 v98.25,69.12 | v100.12,69.12 v108.12,61.12 | v109,60.25 116.75,52.5 R1.1 | 94.62,73.75 v95,73.38 | U1.1 95.22,76.12 94.62,75.53
  Bottom 0.15: v95,73.38 v95.88,72.5 | v98.25,69.12 v100.12,69.12 | v109,60.25 v108.12,61.12
N$2
  Top 0.15: R1.2 Q1.1
N$3
  Top 0.15: R3.2 93.62,59.5 93.25,59.12 93.25,55.38 93.75,54.88 R2.2 102.75,54.75 111.62,63.62 L1.1 113.5,63.5
  Top 3: Q1.3 113.5,63.5 L1.1
N$4
  Top 0.15: R5.2 92.88,59.12 92.88,55.38 R2.1 L2.1
  Top 0.5: C5.1 Q2.2
  Top 3: Q2.2 76,58 L2.1
N$5
  Top 0.15: U2.3 R3.1 R4.1
N$6
  Top 0.15: C2.2 R6.2 91.12,59.75 92.38,61 R5.1 U2.2
N$7
  Top 0.15: C2.1 R6.1 U2.1 91.12,63.25 93.88,66 96.5,66 98.88,68.38 C1.2 R7.2
N$8  (via drill 0.3)
  Top 0.15: U2.6 U2.7 92.38,69.5 90.88,71 89.5,71 v86.12,74.38 | v84.5,76 74.5,76 R16.2
  Bottom 0.15: v86.12,74.38 v84.5,76
N$9  (2 unrouted)
N$10
  Top 0.15: U1.3 93.88,78.62 93.38,79.12 C4.2 R12.2
N$11  (2 unrouted)
N$12
  Top 1: L1.2 107.38,51.5 R28.2
  Top 2: RL1.21 98,39.25 98,46 L1.2
N$13
  Top 0.152: R11.2 70.12,36.95 70.18,36.9 U12.1
N$14
  Top 0.5: C6.1 RL1.11
  Bottom 2: RL1.11 96.75,40.5 91.62,40.5 80.62,51.5 L2.2
N$15
  Top 0.5: U11.1 120.25,118.25 R26.1 R27.2
N$16
  Top 0.15: U6.9 61.35,83.47 C22.2 C21.2 C25.2
N$17  (via drill 1)
  Top 0.5: C7.2 128.25,58
  Top 0.8: C7.2 Q1.2
  Top 2: 128.25,58 v125.5,58 v125.5,59.75 | C8.2 124,69.75 | 124,69.75 C9.2 | L3.1 124,69.75
  Bottom 2: v125.5,59.75 125.5,69.75 | 125.5,69.75 C9.2 | 125.5,69.75 C8.2
  Bottom 3: v125.5,58 v125.5,59.75
N$18
  Top 0.15: U1.5 90.3,81.05 90.38,81.12 C18.2 R13.2
N$19
  Top 0.5: D1.A 77.88,39.38 RL1.A2 80.36,36.9 U12.4
N$20
  Top 0.15: U4.10 107,86.25 C11.2 C12.2
N$21
  Top 0.15: U4.2 93.62,85.75 92.12,84.25 R12.1
N$22
  Top 0.15: U5.10 81.5,86.38 C15.2 C16.2
N$23
  Top 0.15: U5.2 88.5,86.88 89.62,85.75 R13.1
N$24
  Top 0.15: U6.8 57.15,83.47 C22.1 C21.1 C26.2
N$25
  Top 0.15: 63,130.15 62.12,131.03 U9.5 | C43.2 63,130.15 | R24.1 63.02,130.12 63,130.15
  Top 0.5: U10.1 53,129 C45.2 51.75,128 52,127.75 61.75,127.75 63,129 C43.2
N$26
  Top 1.5: D5.A D6.K 51.75,142.8 51.7,142.75 3.25,142.75 TP4.1
N$27
  Top 1.5: D4.K D3.A 53.05,139.5 9.75,139.5 8.25,138 TP3.1
N$28
  Top 0.5: R28.1 C6.2
N$29
  Top 2: R10.4 52.9,52.4 Q2.3
N$30
  Top 0.5: U7.2 93,115.38 C37.2
N$31
  Top 0.5: U7.4 90.5,115.88 C37.1
N$32
  Top 0.5: U7.5 90.5,106.62 C38.2 90.5,106.38 FB1.1
N$33
  Top 0.5: U7.8 94.25,108.3 94.42,108.12 C39.2 96.88,109.5 96.88,115.12 C41.2 U8.3
N$34
  Top 0.15: U9.3 60.1,134.22 R19.1 R20.2
N$35
  Top 0.15: R20.1 58.62,132.88 59.88,131.62 R21.2 61.08,131.62 U9.4
N$37
  Top 0.15: D7.A 69,133.75 R22.1 R23.2 72,132.75 74.75,135.5 Q4.1
N$38
  Top 0.15: Q5.2 R23.1
N$39
  Top 0.15: U9.1 63.08,131.62 | 63.08,131.62 U9.6 | 63.08,131.62 R24.2 65,131.62 Q5.1
N$76  (via drill 0.3, 0.35)  (1 unrouted)
  Top 0.15: 87.88,78.62 75.62,66.38 R17.1 v57.25,60.25 | v57.25,55.75 57.25,48.85 R10.3
  Bottom 0.15: v57.25,60.25 v57.25,55.75
N$345  (1 unrouted)
  Top 0.15: U2.5 94.88,72.38 96.12,73.62 | R7.1 C1.1 | R8.2 R7.1 | U1.2 R7.1
OUTPUT_RLY_EN  (via drill 0.3)  (1 unrouted)
  Top 0.15: 71.62,38.22 71.62,28.12 70.12,26.62 70.12,4.12 66.38,0.38 10.88,0.38 0.38,10.88 0.38,84.88 1.25,85.75 30,85.75 v32.62,88.38 | v33.75,89.5 33,90.25 33,93 CN2.16
  Bottom 0.15: v32.62,88.38 v33.75,89.5
PGND  (via drill 0.3, 0.5, 1)
  Top 0.15: U9.2 v62.12,133.38 | R21.1 v58.5,130.62 | C43.1 v60.5,130.12 | Q5.3 v65.62,129.12
  Top 0.5: C45.1 v51.75,131.62 | U10.2 v54.25,130.62 | U10.3 v55.5,130.62 | U10.7 v54.25,133.5 | U10.6 v55.5,133.5 | C44.1 v51.75,132.62 | v22.75,127.75 v22.75,126.88 | v22.75,126.88 v23.62,126.88 | v22.75,126.88 v21.88,126.88
  Top 1: D6.A v51.75,146.75 | D4.A v55.25,146.75 | CN2.11 22.75,94.27 CN2.12 CN2.9 CN2.10 CN2.11
  Top 3: 22.75,94.27 v22.75,126 v22.75,126.88
  Bottom 0.5: v22.75,126.88 21.62,126.88
  pour Bottom (rank 6): 0,186 113,186 113,123 113,71 0,71
  pour Top (rank 6): 0,186 113,186 113,123 113,71 0,71
VIN
  Top 0.15: Q4.3 R22.2 69,135.75 D7.K
  Top 0.5: U10.8 53,135.25 C44.2 D5.K | R19.2 58.5,137.3
  Top 1: Q4.3 71.5,140.12 71.38,140.25
  Top 1.5: D5.K D3.K 58.5,137.3 60.8,137.3 C31.2 69.25,140.25 | 69.25,140.25 71.38,140.25 C32.2 | C33.2 69.25,140.25
VOUT
  Top 1: CN2.14 28,94.27 CN2.13 CN2.8 CN2.7 CN2.14
  Top 3: U3.2 83.59,131.84 80.25,128.5 Q4.2 57.12,111.88 42,111.88 28,97.88 28,94.27
VOUT+
  Top 2: RL1.24 105.5,33.62 98,26.12 TP1.1 D8.K
VOUT-
  Top 2: RL1.14 103,41.75 103,35.25 97.62,29.88 91.12,29.88 88,26.75 TP2.1 D8.A